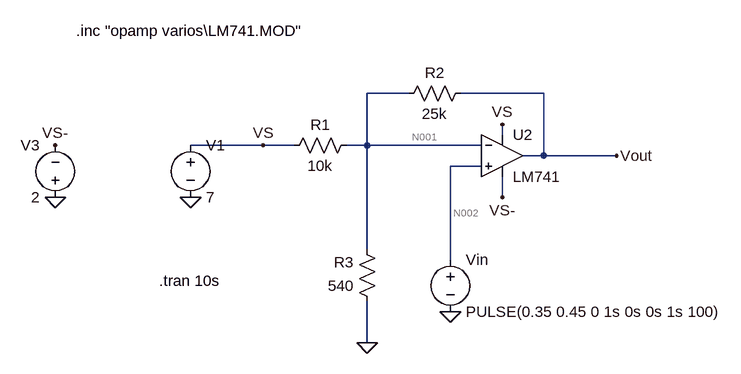
[diagram p0: schematic temperatura.asc]
temperatura.asc, the LTspice schematic file:
Version 4
SHEET 1 1060 680
WIRE 240 32 176 32
WIRE 448 32 320 32
WIRE 384 96 384 80
WIRE 16 112 -96 112
WIRE 64 112 16 112
WIRE 176 112 176 32
WIRE 176 112 144 112
WIRE 352 112 176 112
WIRE 448 128 448 32
WIRE 448 128 416 128
WIRE 560 128 448 128
WIRE 352 144 304 144
WIRE 384 192 384 160
WIRE 176 272 176 112
WIRE 304 288 304 144
WIRE 176 416 176 352
FLAG 176 416 0
FLAG -96 192 0
FLAG 384 80 VS
FLAG 16 112 VS
FLAG 304 368 0
FLAG -304 192 0
FLAG -304 112 VS-
FLAG 384 192 VS-
FLAG 560 128 Vout
SYMBOL res 160 96 R90
WINDOW 0 0 56 VBottom 2
WINDOW 3 32 56 VTop 2
SYMATTR InstName R1
SYMATTR Value 10k
SYMBOL res 192 368 R180
WINDOW 0 36 76 Left 2
WINDOW 3 36 40 Left 2
SYMATTR InstName R3
SYMATTR Value 540
SYMBOL res 224 48 R270
WINDOW 0 32 56 VTop 2
WINDOW 3 0 56 VBottom 2
SYMATTR InstName R2
SYMATTR Value 25k
SYMBOL voltage -96 96 R0
WINDOW 123 0 0 Left 2
WINDOW 39 0 0 Left 2
SYMATTR InstName V1
SYMATTR Value 7
SYMBOL voltage 304 272 R0
WINDOW 123 0 0 Left 2
WINDOW 39 0 0 Left 2
SYMATTR InstName Vin
SYMATTR Value PULSE(0.35 0.45 0 1s 0s 0s 1s 100)
SYMBOL voltage -304 208 R180
WINDOW 0 24 96 Left 2
WINDOW 3 24 16 Left 2
WINDOW 123 0 0 Left 2
WINDOW 39 0 0 Left 2
SYMATTR InstName V3
SYMATTR Value 2
SYMBOL Opamps\\opamp2 384 64 R0
SYMATTR InstName U2
SYMATTR Value LM741
TEXT -272 -64 Left 2 !.inc "opamp varios\\LM741.MOD"
TEXT -144 320 Left 2 !.tran 10s

The netlist it stands for:
* temperatura.asc
R1 N001 VS 10k
R3 0 N001 540
R2 N001 Vout 25k
V1 VS 0 7
Vin N002 0 PULSE(0.35 0.45 0 1s 0s 0s 1s 100)
V3 0 VS- 2
XU2 N002 N001 VS VS- Vout LM741  ; pins In+ In- V+ V- OUT
.inc "opamp varios\LM741.MOD"
.tran 10s
.backanno
.end

* Results of the author's LTspice run, read from the files saved beside the schematic
* Operating Point, zero values left out:
*   V(n001) = 350.9 mV
*   V(vs) = 7 V
*   V(vout) = -21.71 mV
*   V(n002) = 350 mV
*   V(vs-) = -2 V
*   I(R2) = 14.91 µA
*   I(R3) = -649.9 µA
*   I(R1) = -664.9 µA
*   I(V3) = -1.447 mA
*   I(Vin) = -57.96 nA
*   I(V1) = -2.096 mA
*   Ix(u2:1) = 57.96 nA
*   Ix(u2:2) = 101.8 nA
*   Ix(u2:99) = 1.431 mA
*   Ix(u2:50) = -1.447 mA
*   Ix(u2:28) = 14.91 µA
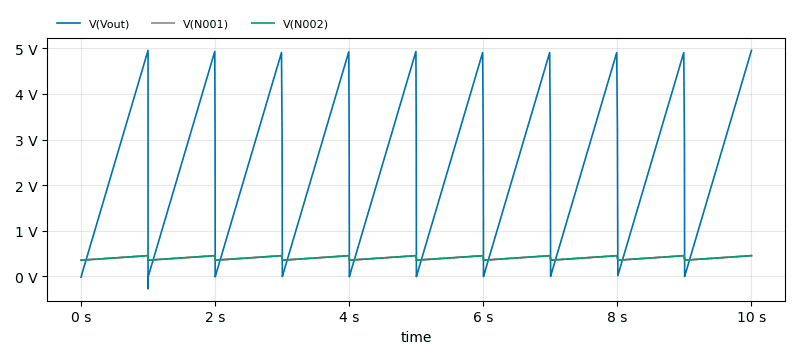
[diagram p1: Transient Analysis of temperatura.asc, plotted from the saved traces]
* Transient Analysis, 1 run:
*   V(Vout): min -277.3 mV, max 4.957 V, average 2.465 V, rms 3.002 V, last 4.956 V
*   V(N001): min 345.8 mV, max 450.9 mV, average 400.9 mV, rms 402.4 mV, last 450.9 mV
*   V(N002): min 350 mV, max 450 mV, average 399.9 mV, rms 401.4 mV, last 450 mV